# EAGLE design Logics I2C SMD Adapter v1.4 (EAGLE 6.4)
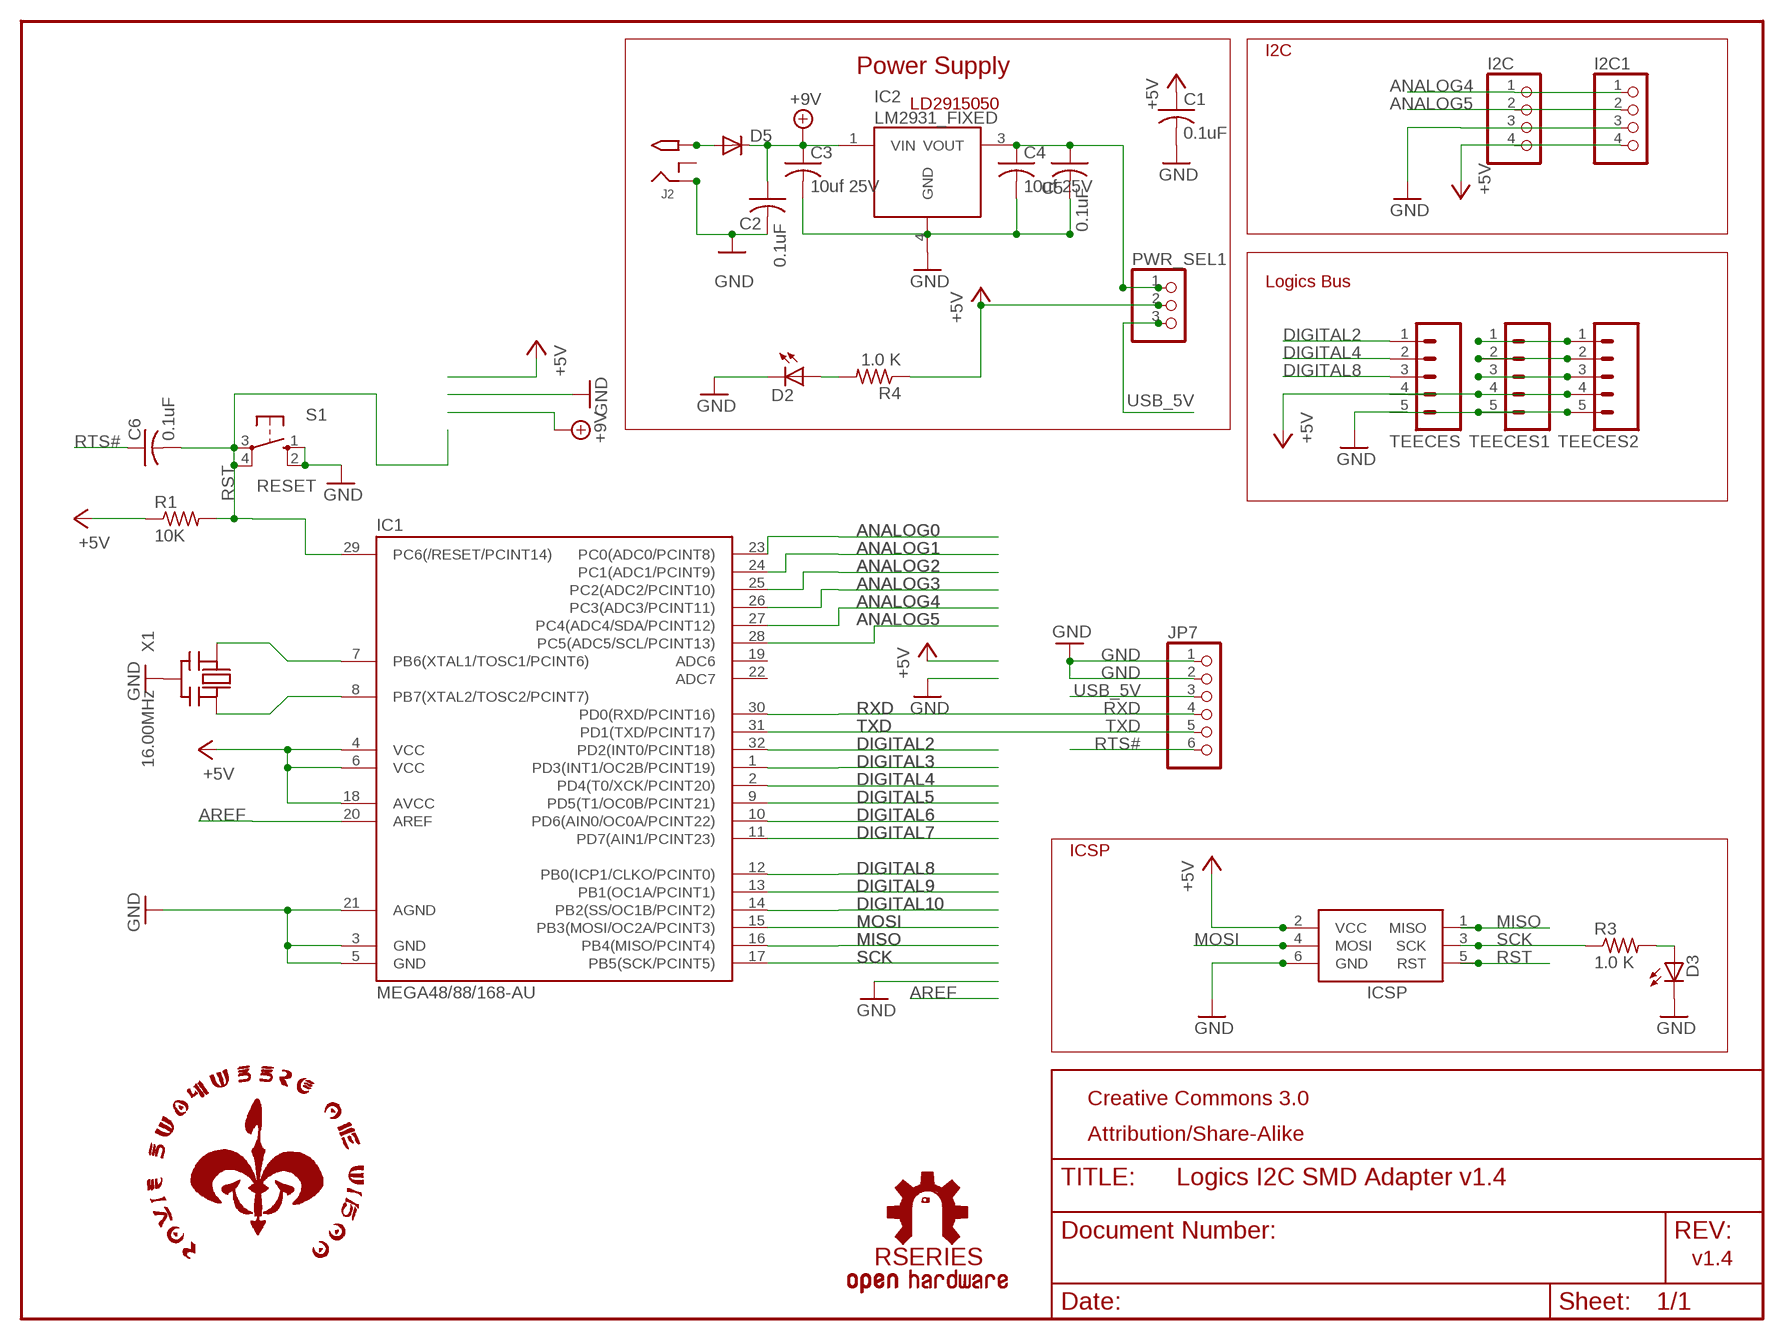
[diagram p0: schematic, sheet 1]

## Parts
C1  0.1uF  C-USC1206K  [C1206K]
C2  0.1uF  C-USC1206K  [C1206K]
C3  10uf 25V  C-USC1206K  [C1206K]
C4  10uf 25V  C-USC1206K  [C1206K]
C5  0.1uF  C-USC1206K  [C1206K]
C6  0.1uF  C-USC1206K  [C1206K]
D2  LEDCHIPLED_1206  [CHIPLED_1206]
D3  Green  LEDCHIPLED_1206  [CHIPLED_1206]
D5  DIODE-SMB  [SMB]
I2C  PINHD-1X4CB  [1X04-CB]
I2C1  PINHD-1X4CB  [1X04-CB]
IC1  MEGA48/88/168-AU  [TQFP32-08]
IC2  LM2931_FIXED  [DPAK]
ICSP  AVRISP-6  [AVRISP]
J2  2.1MMJACK  [PJ-102A]
JP7  PINHD-1X6CLEAN  [1X06-CLEAN]
PWR_SEL1  PINHD-1X3  [1X03]
R1  10K  R-US_R1206  [R1206]
R3  1.0 K  R-US_M1206  [M1206]
R4  1.0 K  R-US_M1206  [M1206]
S1  RESET  10-XX  [B3F-10XX]
TEECES  M05PTH  [1X05]
TEECES1  M05PTH  [1X05]
TEECES2  M05PTH  [1X05]
U$1  ROYAL-ENGINEERS-OF-NABOOSMALL  [ROYAL-ENGINEERS-OF-NABOO-SMALL]
U$2  RSERIES-OSHW-LOGOMEDIUM  [RSERIES-OSHW-LOGO-MEDIUM]
X1  16.00MHz  CERMOSCILL  [CERM_OSC]

## Nets
+5V [supply]: C1.1 I2C1.4 I2C.4 IC1.4(VCC) IC1.6(VCC) IC1.18(AVCC) ICSP.2(VCC) PWR_SEL1.2 R1.1 R4.1 TEECES1.4 TEECES2.4 TEECES.4
+9V [supply]: C2.1 C3.1 D5.C IC2.1(VIN)
ANALOG0: IC1.23(PC0(ADC0/PCINT8))
ANALOG1: IC1.24(PC1(ADC1/PCINT9))
ANALOG2: IC1.25(PC2(ADC2/PCINT10))
ANALOG3: IC1.26(PC3(ADC3/PCINT11))
ANALOG4: I2C1.1 I2C.1 IC1.27(PC4(ADC4/SDA/PCINT12))
ANALOG5: I2C1.2 I2C.2 IC1.28(PC5(ADC5/SCL/PCINT13))
AREF: IC1.20(AREF)
DIGITAL2: IC1.32(PD2(INT0/PCINT18)) TEECES.1
DIGITAL3: IC1.1(PD3(INT1/OC2B/PCINT19))
DIGITAL4: IC1.2(PD4(T0/XCK/PCINT20)) TEECES.2
DIGITAL5: IC1.9(PD5(T1/OC0B/PCINT21))
DIGITAL6: IC1.10(PD6(AIN0/OC0A/PCINT22))
DIGITAL7: IC1.11(PD7(AIN1/PCINT23))
DIGITAL8: IC1.12(PB0(ICP1/CLKO/PCINT0)) TEECES.3
DIGITAL9: IC1.13(PB1(OC1A/PCINT1))
DIGITAL10: IC1.14(PB2(SS/OC1B/PCINT2))
GND [supply]: C1.2 C2.2 D2.C D3.C I2C1.3 I2C.3 IC1.3(GND) IC1.5(GND) IC1.21(AGND) IC2.4(GND) ICSP.6(GND) J2.RING JP7.1 JP7.2 S1.1(S) S1.2(S1) TEECES1.5 TEECES2.5 TEECES.5 X1.P$2(GND)
MISO: IC1.16(PB4(MISO/PCINT4)) ICSP.1(MISO)
MOSI: IC1.15(PB3(MOSI/OC2A/PCINT3)) ICSP.4(MOSI)
N$1: IC1.7(PB6(XTAL1/TOSC1/PCINT6)) X1.P$1(IN)
N$2: IC1.8(PB7(XTAL2/TOSC2/PCINT7)) X1.P$3(OUT)
N$3: TEECES1.3 TEECES2.3
N$4: D3.A R3.2
N$5 [supply]: D2.A R4.2
N$6 [supply]: D5.A J2.TIP
N$7: TEECES1.2 TEECES2.2
N$8: C3.2 C4.2 C5.2
N$9 [supply]: C4.1 C5.1 IC2.3(VOUT) PWR_SEL1.1
N$10: TEECES1.1 TEECES2.1
RST: C6.2 IC1.29(PC6(/RESET/PCINT14)) ICSP.5(RST) R1.2 S1.3(P) S1.4(P1)
RTS#: C6.1 JP7.6
RXD: IC1.30(PD0(RXD/PCINT16)) JP7.4
SCK: IC1.17(PB5(SCK/PCINT5)) ICSP.3(SCK) R3.1
TXD: IC1.31(PD1(TXD/PCINT17)) JP7.5
USB_5V [supply]: JP7.3 PWR_SEL1.3
Unconnected: IC1.19(ADC6) IC1.22(ADC7) J2.RING_SW

## Notes on the sheet
- I2C
- Power Supply
- LD2915050
- Logics Bus
- ICSP
- Creative Commons 3.0
- Attribution/Share-Alike
- v1.4

## Library data of the parts
C1 C2 C5 C6 = minimidi:C-US: CAPACITOR, American symbol
C3 C4 = rcl:C-US: CAPACITOR, American symbol
D2 D3 = minimidi:LED: LED OSRAM: - CHIPLED LG R971, LG N971, LY N971, LG Q971, LY Q971, LO R971, LY R971 LH N974, LH R974 LS Q976, LO Q976, LY Q976 LO Q996 - Hyper CHIPLED LW Q18S LB Q993, LB Q99A, LB R99A - SideLED LS A670, LO A670, LY A670, LG A670, LP A670 LB A673, LV A673, LT A673, LW A673 LH A674 LY A675 LS A676, LA A676, LO A676, LY A676, LW A676 LS A679, LY A679, LG A679 - Hyper Micro SIDELED® LS Y876, LA Y876, LO Y876, LY Y876 LT Y87S - SmartLED LW L88C, LW L88S LB L89C, LB L89S, LG L890 LS L89K, LO L89K, LY L89K LS L896, LA L896, LO L896, LY L896 - TOPLED LS T670, LO T670, LY T670, LG T670, LP T670 LSG T670, LSP T670, LSY T670, LOP T670, LYG T670 LG T671, LOG T671, LSG T671 LB T673, LV T673, LT T673, LW T673 LH T674 LS T676, LA T676, LO T676, LY T676, LB T676, LH T676, LSB T676, LW T676 LB T67C, LV T67C, LT T67C, LS T67K, LO T67K, LY T67K, LW E67C LS E67B, LA E67B, LO E67B, LY E67B, LB E67C, LV E67C, LT E67C LW T67C LS T679, LY T679, LG T679 LS T770, LO T770, LY T770, LG T770, LP T770 LB T773, LV T773, LT T773, LW T773 LH T774 LS E675, LA E675, LY E675, LS T675 LS T776, LA T776, LO T776, LY T776, LB T776 LHGB T686 LT T68C, LB T68C - Hyper Mini TOPLED® LB M676 - Mini TOPLED Santana® LG M470 LS M47K, LO M47K, LY M47K Source: http://www.osram.convergy.de/
D5 = diode:DIODE-: DIODE
I2C I2C1 = carduino:PINHD-1X4: PIN HEADER
IC1 = avr-7:MEGA48/88/168
IC2 = SparkFun-PowerIC:LM2931_FIXED: LDO regulator with reverse battery protection- very durable!
ICSP = adafruit:AVRISP: AVR ISP HEADER Standard 6 pin header for AVR programming
J2 = minimidi:2.1MMJACK
JP7 = carduino:PINHD-1X6: PIN HEADER
PWR_SEL1 = pinhead:PINHD-1X3: PIN HEADER
R1 = rcl-ez:R-US_: RESISTOR, American symbol
R3 R4 = minimidi:R-US_: RESISTOR, American symbol
S1 = switch-omron:10-XX: OMRON SWITCH
TEECES TEECES1 TEECES2 = SparkFun-Connectors:M05: Header 5 Standard 5-pin 0.1" header. Use with straight break away headers (SKU : PRT-00116), right angle break away headers (PRT-00553), swiss pins (PRT-00743), machine pins (PRT-00117), and female headers (PRT-00115). Molex polarized connector foot print use with SKU : PRT-08230 with associated crimp pins and housings.
U$1 = rseries:ROYAL-ENGINEERS-OF-NABOO: Royal Engineers of Naboo Circle Logo
U$2 = rseries:RSERIES-OSHW-LOGO
X1 = digg:CERMOSCILL

## Net classes
1 supply: width 0.381 mm, drill 0.152 mm, clearance 0.152 mm

## Board
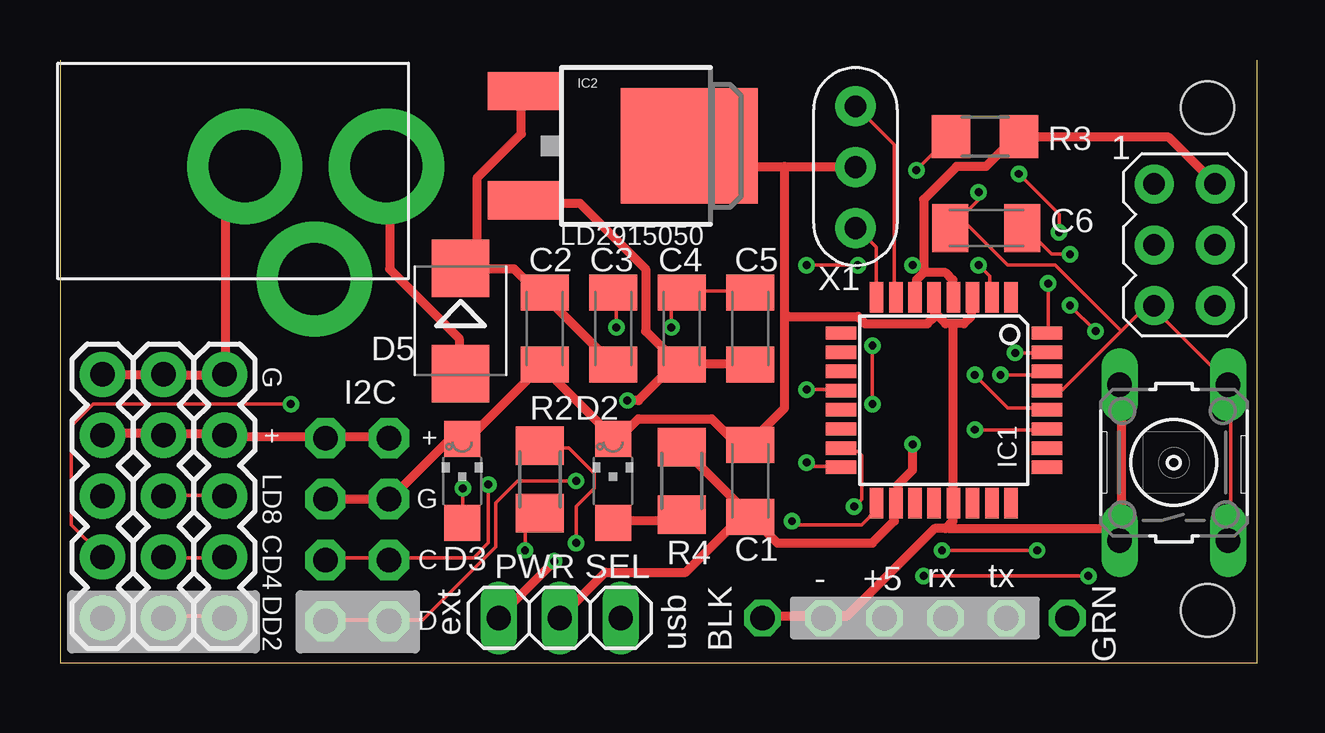
[diagram p1: board, top side]
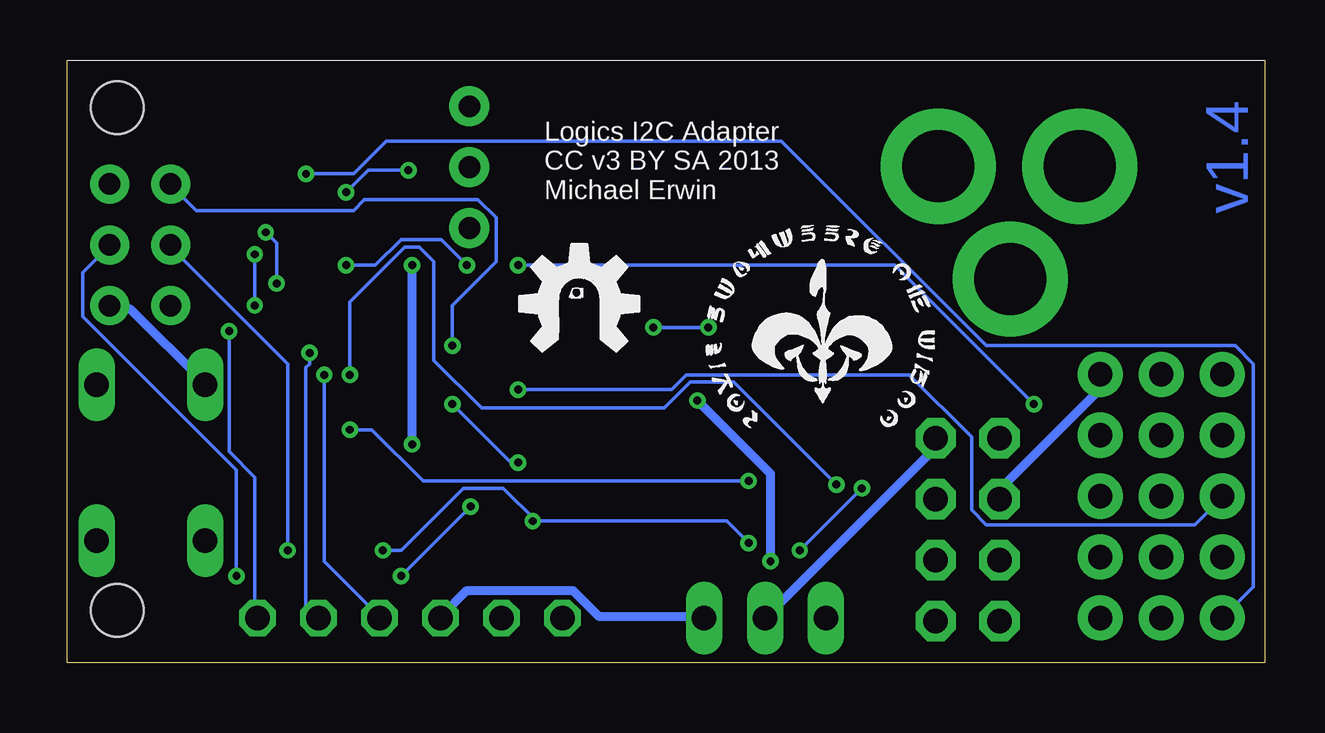
[diagram p2: board, bottom side, seen from below]

Size 49.89 x 25.13 mm. Coordinates in mm from the lower left corner, seen from the top.
Outline: 49.89,25.13 49.89,0 0,0 0,25.13
Copper layers (1*16): Top 0.0356mm / dielectric 1.5011mm / Bottom 0.0356mm
Design rules "LaenPCBOrder *": minimum track width 6mil, minimum drill 13mil, track to track 6mil, track to pad 6mil, pad to pad 6mil, via to via 12mil, smd to smd 6mil, copper to edge 15mil, drill to drill 6mil, minimum pad ring 7mil, minimum via ring 7mil, stop-mask expansion 4mil, vias tented up to drill 14mil, thermal gap 10mil
Holes 2.2 mm at 47.81,2.18 47.81,23.14

### Footprints (pad centres in the part's own frame; a part is rotated, then mirrored left to right if it is on the bottom)
C1206K = smd 1.5 x 2: 1 -1.5,0; 2 1.5,0
CHIPLED_1206 = smd 1.5 x 1.5: A 0,-1.75; C 0,1.75
SMB = smd 2.4 x 2.4: A 2.2,0; C -2.2,0
1X04-CB = drill 1.016 pad 1.676 octagon: 1 -3.81,0; 2 -1.27,0; 3 1.27,0; 4 3.81,0
TQFP32-08 = smd 1.27 x 0.559: 1 -4.293,2.8; 2 -4.293,2; 3 -4.293,1.2; 4 -4.293,0.4; 5 -4.293,-0.4; 6 -4.293,-1.2; 7 -4.293,-2; 8 -4.293,-2.8; 17 4.293,-2.8; 18 4.293,-2; 19 4.293,-1.2; 20 4.293,-0.4; 21 4.293,0.4; 22 4.293,1.2; 23 4.293,2; 24 4.293,2.8 | smd 0.559 x 1.27: 9 -2.8,-4.293; 10 -2,-4.293; 11 -1.2,-4.293; 12 -0.4,-4.293; 13 0.4,-4.293; 14 1.2,-4.293; 15 2,-4.293; 16 2.8,-4.293; 25 2.8,4.293; 26 2,4.293; 27 1.2,4.293; 28 0.4,4.293; 29 -0.4,4.293; 30 -1.2,4.293; 31 -2,4.293; 32 -2.8,4.293
DPAK = smd 1.6 x 3: 1 -2.28,-5.31; 3 2.28,-5.31 | smd 4.826 x 5.715: 4 0,1.588
AVRISP = drill 0.9 pad 1.626: 1 -1.27,2.54; 2 1.27,2.54; 3 -1.27,0; 4 1.27,0; 5 -1.27,-2.54; 6 1.27,-2.54
PJ-102A = drill 3 pad 4.8: RING 0.1,-3.39; RING_SW -4.6,-6.29; TIP 0.1,-9.29
1X06-CLEAN = drill 1.016 octagon: 1 -6.35,0; 2 -3.81,0; 3 -1.27,0; 4 1.27,0; 5 3.81,0; 6 6.35,0
1X03 = drill 1.016 long: 1 -2.54,0; 2 0,0; 3 2.54,0
R1206 = smd 1.6 x 1.803: 1 -1.422,0; 2 1.422,0
M1206 = smd 1.6 x 2: 1 -1.4,0; 2 1.4,0
B3F-10XX = drill 1.016 long: 1 -3.251,2.261; 2 3.251,2.261; 3 -3.251,-2.261; 4 3.251,-2.261
1X05 = drill 1.016 pad 1.88: 1 0,0; 2 2.54,0; 3 5.08,0; 4 7.62,0; 5 10.16,0
CERM_OSC = drill 0.9 pad 1.676: P$1 -2.54,0; P$2 0,0; P$3 2.54,0

### Placement (x,y rotation side)
C1  28.76,7.58 90 top
C2  20.19,13.93 270 top
C3  23.05,13.93 90 top
C4  25.9,13.93 90 top
C5  28.76,13.93 90 top
C6  38.6,18.12 180 top
D2  23.05,7.58 0 top
D3  16.76,7.58 0 top
D5  16.7,14.25 270 top
I2C  11.06,5.55 90 top
I2C1  13.71,5.55 90 top
IC1  36.83,10.95 270 top
IC2  24.63,21.55 270 top
ICSP  46.86,17.42 0 top
J2  4.31,20.6 90 top
JP7  35.62,1.87 0 top
PWR_SEL1  20.82,1.87 0 top
R1  38.54,21.93 180 top
R3  20,7.65 270 top
R4  25.9,7.58 270 top
S1  46.41,8.34 90 top
TEECES  1.77,1.87 90 top
TEECES1  4.31,1.87 90 top
TEECES2  6.85,1.87 90 top
U$1  23.36,9.49 0 bottom
U$2  28.67,15.01 0 bottom
X1  33.14,20.66 270 top

### Tracks (layer width: path | path; a pad name or v marks a point on that pad's centre or on a via)
+5V  (via drill 0.33)
  Top 0.381: 35.99,16.27 35.68,15.96 35.68,15.35 IC1.6 | 35.99,16.27 36.9,16.27 37.21,15.96 37.21,15.35 IC1.4 | ICSP.2 48.03,20.08 46.2,21.91 40.1,21.91 R1.1 39.8,21.91 38.58,20.69 37.36,20.69 35.99,19.32 35.99,16.57 | 35.99,16.57 35.99,16.42 35.99,16.27 | C1.1 28.82,6.06 29.89,4.99 33.85,4.99 34.77,5.91 34.77,6.51 IC1.18 34.92,6.82 34.92,7.43 35.53,8.04 v35.53,9.11 | R4.1 25.93,8.95 28.67,6.21 C1.1 | TEECES.4 1.85,9.56 4.29,9.56 TEECES1.4 4.44,9.56 6.73,9.56 TEECES2.4 6.88,9.41 10.99,9.41 I2C.4 11.15,9.41 13.58,9.41 I2C1.4 | C1.1 28.52,6.21 26.08,3.77 22.73,3.77 20.9,1.94 PWR_SEL1.2 | v35.53,16.57 35.83,16.57 35.99,16.57
  Bottom 0.381: PWR_SEL1.2 20.75,1.94 13.74,8.95 13.74,9.26 I2C1.4 | v35.53,9.11 v35.53,16.57
+9V
  Top 0.381: C3.1 23.03,12.46 20.14,15.35 C2.1 19.98,15.35 18.92,16.42 16.78,16.42 D5.C 17.39,16.57 17.39,20.23 19.22,22.06 19.22,23.74 IC2.1
ANALOG4  (via drill 0.33)
  Top 0.152: v38.12,9.72 41.02,9.72 IC1.27 | v21.51,7.58 19.07,7.58 18.16,6.67 18.16,4.84 15.11,1.79 13.74,1.79 I2C1.1 13.58,1.79 11.15,1.79 I2C.1
  Bottom 0.152: v38.12,9.72 37.21,9.72 35.07,7.58 v21.51,7.58
ANALOG5  (via drill 0.33)
  Top 0.152: v38.12,12 39.49,10.63 41.02,10.63 IC1.28 | v17.85,7.43 17.85,4.99 17.24,4.38 13.74,4.38 I2C1.2 13.58,4.38 11.15,4.38 I2C.2
  Bottom 0.152: v38.12,12 38.12,15.05 35.83,17.34 35.23,17.34 34.62,16.73 34.62,12.61 32.63,10.63 25.01,10.63 23.95,11.7 22.12,11.7 v17.85,7.43
DIGITAL2  (via drill 0.33)
  Top 0.152: v41.17,15.81 41.17,13.83 IC1.32 | v41.63,17.95 41.63,18.71 v39.95,20.38
  Bottom 0.152: v41.17,15.81 41.17,17.49 v41.63,17.95 | v39.95,20.38 37.97,20.38 36.6,21.75 20.14,21.75 11.6,13.22 1.24,13.22 0.48,12.46 0.48,3.16 1.7,1.94 TEECES.1
DIGITAL4  (via drill 0.33)
  Top 0.152: v38.27,16.57 38.73,16.12 38.73,15.35 IC1.2 | v31.11,16.57 v33.24,16.57 | v9.62,10.78 1.39,10.78 0.48,9.87 0.48,5.75 1.7,4.53 TEECES.2
  Bottom 0.152: v38.27,16.57 37.05,16.57 35.99,17.64 34.31,17.64 v33.24,16.57 | v31.11,16.57 15.41,16.57 v9.62,10.78
DIGITAL8  (via drill 0.33)
  Top 0.152: v31.11,11.39 32.48,11.39 IC1.12
  Bottom 0.152: v31.11,11.39 24.71,11.39 24.1,12 14.8,12 12.21,9.41 12.21,6.36 11.6,5.75 2.92,5.75 1.85,6.82 TEECES.3
GND
  Top 0.381: S1.2 44.22,11.54 44.22,5.14 S1.1 44.06,5.6 37.05,5.6 36.9,5.6 | JP7.1 29.28,1.94 31.72,1.94 JP7.2 31.87,1.94 32.79,1.94 36.44,5.6 36.9,5.6 | IC1.5 36.44,15.2 IC1.5 | 36.44,14.59 36.44,15.05 IC1.5 | 36.44,14.59 36.9,14.13 37.21,14.13 | 37.21,14.13 37.66,14.13 37.97,14.44 37.97,15.2 IC1.3 | 37.21,14.13 37.21,13.98 37.21,6.67 IC1.21 37.21,6.51 37.21,5.91 36.9,5.6 | IC1.3 38.12,15.2 IC1.3 | TEECES.5 1.85,12 4.29,12 TEECES1.5 4.44,12 6.73,12 TEECES2.5 6.88,12.15 6.88,19.93 7.64,20.69 J2.RING | 30.2,20.69 26.99,20.69 26.23,21.45 IC2.4 | 30.2,20.69 33.09,20.69 X1.P$2 | I2C.3 11.15,6.82 13.58,6.82 I2C1.3 13.74,6.82 16.17,9.26 16.63,9.26 D3.C 16.78,9.41 17.09,9.41 19.98,12.31 C2.2 20.14,12.31 23.03,9.41 D2.C 23.18,9.26 24.1,10.17 27.15,10.17 28.21,9.11 28.67,9.11 C1.2 28.82,9.26 30.2,10.63 30.2,14.44 | 30.2,14.44 30.2,20.54 30.2,20.69 | 36.44,14.59 36.44,14.44 36.14,14.13 33.55,14.13 33.24,14.44 30.35,14.44 30.2,14.44 | 48.18,14.9 ICSP.6 48.18,14.9
  Bottom 0.381: ICSP.6 48.03,14.74 47.26,14.74 44.22,11.7 S1.2 | TEECES2.5 6.88,12 6.88,11.39 10.99,7.28 10.99,6.82 I2C.3
MISO  (via drill 0.33)
  Top 0.152: v31.11,8.34 31.26,8.19 32.48,8.19 IC1.16 | v33.85,13.22 v33.85,10.78
  Bottom 0.152: v31.11,8.34 31.41,8.34 v33.85,10.78 | v33.85,13.22 33.85,14.9 32.02,16.73 32.02,18.55 32.79,19.32 37.51,19.32 37.97,18.86 44.52,18.86 45.59,19.93 ICSP.1
MOSI  (via drill 0.33)
  Top 0.152: v33.09,6.51 33.4,6.82 33.4,8.65 33.24,8.8 32.63,8.8 IC1.15 | v42.84,3.62 v35.99,3.62
  Bottom 0.152: v35.99,3.62 v33.09,6.51 | v42.84,3.62 42.84,8.04 49.25,14.44 49.25,16.27 48.18,17.34 ICSP.4
N$1
  Top 0.152: IC1.7 34.77,15.35 34.77,21.6 33.24,23.13 X1.P$1
N$2
  Top 0.152: IC1.8 34.01,15.35 34.01,17.34 33.24,18.1 X1.P$3
N$3
  Top 0.152: TEECES1.3 4.44,6.97 6.73,6.97 TEECES2.3
N$4  (via drill 0.33)
  Top 0.152: v16.78,7.28 16.78,5.91 D3.A | v19.38,4.69 19.38,5.6 19.98,6.21 R3.2
  Bottom 0.152: v19.38,4.69 v16.78,7.28
N$5
  Top 0.381: D2.A 23.18,5.91 25.62,5.91 25.78,6.06 R4.2
N$6
  Top 0.381: D5.A 16.63,12.15 16.63,13.53 13.74,16.42 13.74,20.69 J2.TIP
N$7
  Top 0.152: TEECES1.2 4.44,4.38 6.73,4.38 TEECES2.2
N$8  (via drill 0.33)
  Top 0.152: v23.18,13.98 23.18,15.35 C3.2 | v25.47,13.98 25.47,15.05 25.78,15.35 C4.2 25.93,15.51 28.67,15.51 C5.2
  Bottom 0.152: v25.47,13.98 v23.18,13.98
N$9  (via drill 0.33)
  Top 0.381: C4.1 25.93,12.46 28.67,12.46 C5.1 | C4.1 25.78,12.46 24.4,13.83 24.4,16.42 21.66,19.16 19.38,19.16 IC2.3 | v20.59,4.23 18.31,1.94 PWR_SEL1.1 | v23.64,10.94 24.1,10.94 25.62,12.46 C4.1
  Bottom 0.381: v20.59,4.23 20.59,7.89 v23.64,10.94
N$10
  Top 0.152: TEECES1.1 4.44,1.94 6.73,1.94 TEECES2.1
RST  (via drill 0.33)
  Top 0.152: S1.3 48.79,5.14 48.79,11.54 S1.4 48.64,11.7 45.59,14.74 | v35.68,20.54 37.05,21.91 R1.2 | v38.27,19.62 38.27,19.32 37.51,18.55 | 37.51,18.55 37.21,18.25 C6.2 37.51,18.55 | 44.22,13.83 45.13,14.74 45.59,14.74 | 44.22,13.83 41.78,11.39 41.17,11.39 IC1.29 | 45.59,14.74 ICSP.5 45.59,14.74 | 37.51,18.55 39.49,16.57 41.47,16.57 44.22,13.83
  Bottom 0.152: v35.68,20.54 37.36,20.54 v38.27,19.62
RTS#  (via drill 0.33)
  Top 0.152: v42.08,17.03 41.32,17.03 40.25,18.1 C6.1 | v43.15,13.83 v42.08,14.9
  Bottom 0.152: v42.08,14.9 v42.08,17.03 | v43.15,13.83 43.15,8.8 42.08,7.73 42.08,1.94 JP7.6
RXD  (via drill 0.33)
  Top 0.152: v39.19,12 41.02,12 IC1.30
  Bottom 0.152: v39.19,12 39.19,4.23 36.9,1.94 JP7.4
SCK  (via drill 0.33)
  Top 0.152: v30.5,5.91 30.65,5.75 33.4,5.75 34.01,6.36 34.01,6.51 IC1.17 | v21.51,4.99 21.51,6.51 22.27,7.28 22.27,7.89 21.2,8.95 20.14,8.95 R3.1 | v36.75,4.69 v40.71,4.69
  Bottom 0.152: 30.35,5.91 22.42,5.91 v21.51,4.99 | 30.35,5.91 v30.5,5.91 30.35,5.91 | v40.71,4.69 40.71,12.46 45.59,17.34 ICSP.3 | v36.75,4.69 35.99,4.69 33.4,7.28 31.72,7.28 30.35,5.91
TXD  (via drill 0.33)
  Top 0.152: v39.8,12.92 41.02,12.92 IC1.31
  Bottom 0.152: v39.8,12.92 39.8,12.46 39.95,12.31 39.95,2.4 39.49,1.94 JP7.5
USB_5V
  Bottom 0.381: PWR_SEL1.3 23.49,1.94 27.76,1.94 28.82,3.01 33.24,3.01 34.31,1.94 JP7.3

### Text on the board
Bottom: v1.4
tPlace: R3 | X1 | R2 | D3 | PWR SEL | ext | BLK | - | +5 | rx | tx | GRN | usb
_tsilk: C6 | LD2915050 | G | + | + | LD8 | G | CD4 | C | DD2 | D
_bsilk: Logics I2C Adapter / CC v3 BY SA 2013 / Michael Erwin